# Altium schematic sheet lcd.SchDoc
size A4; SheetNumber: 4; SheetTotal: 6
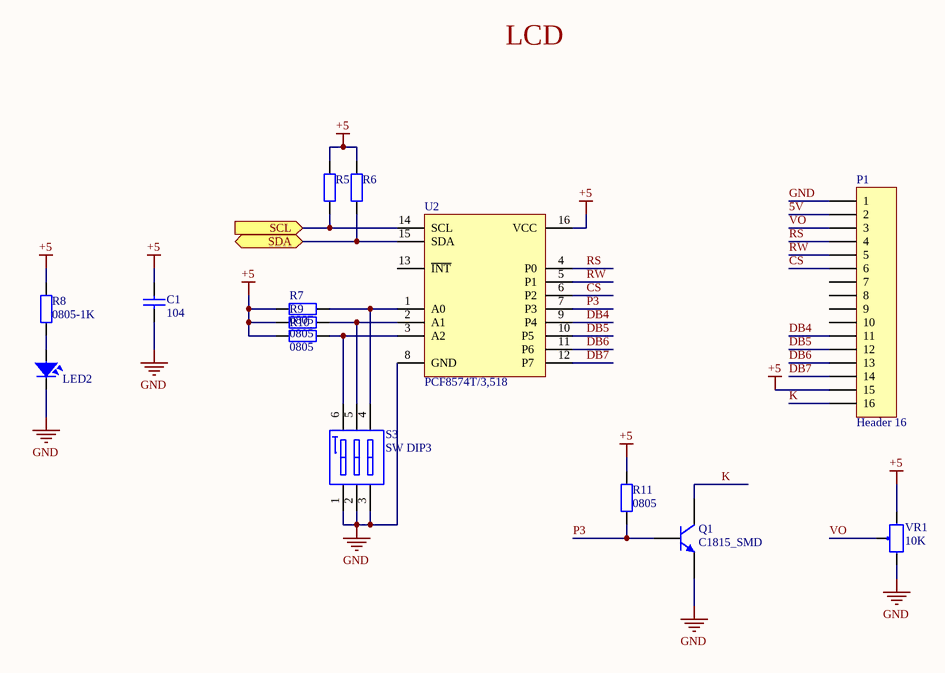
[diagram p0: lcd.SchDoc]

## Parts
C1  104  [0805]
LED2  LED  [LED-0805-Orange]  (value not drawn)
P1  Header 16  [HDR1X16]
Q1  C1815_SMD  [SOT23]
R5  R0805-4k7  [DIEN TRO 0805]  (value not drawn)
R6  R0805-4k7  [DIEN TRO 0805]  (value not drawn)
R7  value 0805  [DIEN TRO 0805]  (hidden comment: R0805-10K)
R8  value 0805-1K  [DIEN TRO 0805]  (hidden comment: R0805)
R9  value 0805  [DIEN TRO 0805]  (hidden comment: R0805-10K)
R10  value 0805  [DIEN TRO 0805]  (hidden comment: R0805-10K)
R11  value 0805  [DIEN TRO 0805]  (hidden comment: R0805)
S3  SW DIP3  [DIPSWITCH3]
U2  PCF8574T/3,518  [SO-16-WIDE]
VR1  10K  [VR]

## Ports
SCL (in), SDA (bidir)

## Nets
+5: C1.2 P1.15 R5.2 R6.2 R7.1 R8.2 R9.1 R10.1 R11.2 U2.16(VCC) VR1.3
GND: C1.1 LED2.2 P1.1 Q1.2(E) S3.1(A1) S3.2(A2) S3.3(A3) U2.8(GND) VR1.1
5V: P1.2
CS: P1.6 U2.6(P2)
DB4: P1.11 U2.9(P4)
DB5: P1.12 U2.10(P5)
DB6: P1.13 U2.11(P6)
DB7: P1.14 U2.12(P7)
K: P1.16 Q1.3(C)
P3: Q1.1(B) R11.1 U2.7(P3)
RS: P1.4 U2.4(P0)
RW: P1.5 U2.5(P1)
SCL: R5.1 U2.14(SCL) ; port SCL
SDA: R6.1 U2.15(SDA) ; port SDA
VO: P1.3 VR1.2
NetLED2_1: LED2.1 R8.1
NetR7_2: R7.2 S3.4(B3) U2.1(A0)
NetR9_2: R9.2 S3.5(B2) U2.2(A1)
NetR10_2: R10.2 S3.6(B1) U2.3(A2)

Not connected (* = marked no-connect by the designer): P1 7 8 9 10; U2 13(~{INT})

## Notes on the sheet
- LCD

## Library data of the parts
C1 = Cap 104_SMD: Capacitor (Semiconductor SIM Model); Value: 0.1uF; Published: 8-Jun-2000; LatestRevisionDate: 17-Jul-2002; LatestRevisionNote: Re-released for DXP Platform.; PackageReference: C1206; Publisher: Altium Limited
LED2 = LED SMD: Value: LED 3 - 5 ly 2 Colour
P1 = Header 16: Header, 16-Pin; LatestRevisionDate: 17-Jul-2002; LatestRevisionNote: Re-released for DXP Platform.; Publisher: Altium Limited
Q1 = C1815_SMD: NPN General Purpose Amplifier; Published: 8-Jun-2000; LatestRevisionDate: 15-Jan-2003; LatestRevisionNote: PCB Footprint 'BCY-W3/D4.7' replaced; DatasheetVersion: 1997; PackageVersion: Sep-1998; PackageReference: TO-92A; Publisher: Altium Limited; Code_JEDEC: TO-92A; ComponentLink1Description: Manufacturer Link; ComponentLink1URL: http://www.fairchildsemi.com/; ComponentLink2Description: Datasheet; ComponentLink2URL: http://www.fairchildsemi.com/ds/2N%2F2N3904.pdf
R5 R6 R11 = R0805: Resistor SMD 0805; Published: 8-Jun-2000; LatestRevisionDate: 17-Jul-2002; LatestRevisionNote: Re-released for DXP Platform.; PackageReference: AXIAL-0.4; Publisher: Altium Limited
  R5 R6: Value: 0805-4k7
R7 R9 R10 = R0805: Resistor SMD 0805-10K; Published: 8-Jun-2000; LatestRevisionDate: 17-Jul-2002; LatestRevisionNote: Re-released for DXP Platform.; PackageReference: AXIAL-0.4; Publisher: Altium Limited
R8 = R0805: Resistor SMD 0805-1K; Published: 8-Jun-2000; LatestRevisionDate: 17-Jul-2002; LatestRevisionNote: Re-released for DXP Platform.; PackageReference: AXIAL-0.4; Publisher: Altium Limited
S3 = SW DIP3: DIP Switch, 3 Position, SPST; Published: 24-Mar-1999; LatestRevisionDate: 17-Jul-2002; LatestRevisionNote: Re-released for DXP Platform.; PackageReference: DIP-6; Publisher: Altium Limited; Code_JEDEC: MO-001-AM
U2 = PCF8574T/3,518: IC I/O EXPANDER I2C 8B 16SOIC; Manufacturer: NXP USA Inc.; Number of I/O: 8; Interface: I²C; Interrupt Output: Yes; Output Type: Push-Pull; Current - Output Source/Sink: 300µA, 25mA; Voltage - Supply: 2.5 V ~ 6 V; Supplier 1: Digi-Key; Manufacturer Part Number: PCF8574T/3,518; RoHS: RoHS Compliant; Category: Integrated Circuits (ICs); Stock 1: 21482; Pricing 1: 1=1.22, 10=1.094, 100=0.8528, 500=0.70452 (USD); Packaging: Cut Tape (CT); Part Status: Active; Features: POR; Operating Temperature: -40°C ~ 85°C; Mounting Type: Surface Mount; Package / Case: 16-SOIC (0.295", 7.50mm Width); Supplier Device Package: 16-SO; ComponentLink1URL: http://www.nxp.com/documents/data_sheet/PCF8574_PCF8574A.pdf; ComponentLink1Description: http://www.nxp.com/documents/data_sheet/PCF8574_PCF8574A.pdf; Supplier Part Number 1: 568-1077-1-ND
VR1 = VR_1: Var Resistor; Value: VR 10K